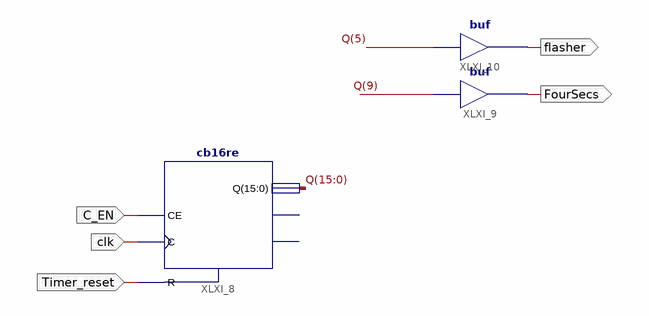
[diagram p0: schematic sheet 1]
// Xilinx ISE schematic T_Count.sch (spartan3e) as structural Verilog: 3 symbols, 5 ports
module T_Count (
  input  clk,
  input  C_EN,
  input  Timer_reset,
  output FourSecs,
  output flasher
);

  wire [15:0] Q;

  cb16re XLXI_8 (.C(clk), .CE(C_EN), .R(Timer_reset), .Q(Q));  // open: CEO, TC
  buf XLXI_9 (FourSecs, Q[9]);
  buf XLXI_10 (flasher, Q[5]);
endmodule
